# EAGLE design SO2Rduino-V2 (EAGLE 5.10)

## Sheet 1 of 3
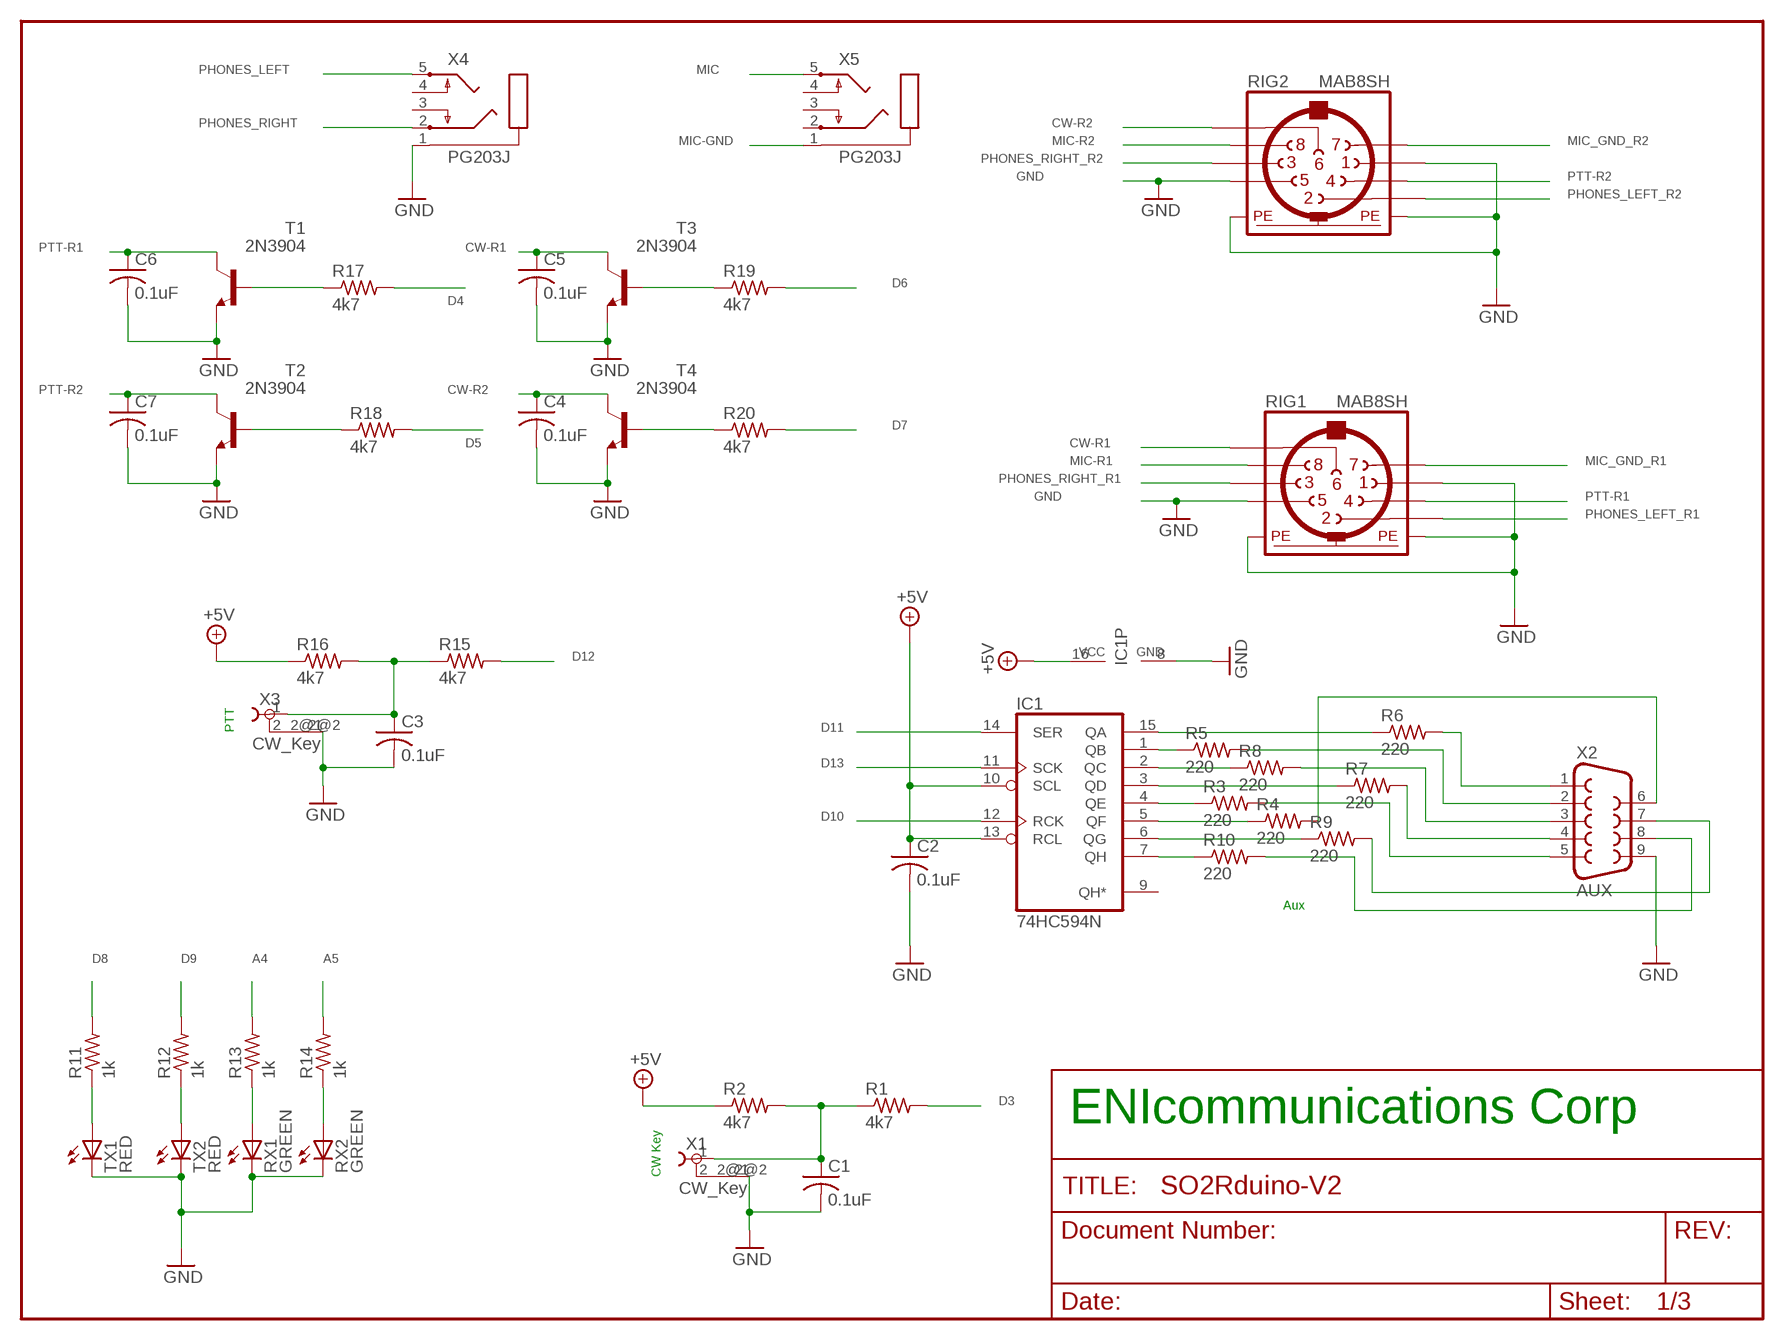
[diagram p0: schematic, sheet 1]

### Parts
C1  0.1uF  C-US025-025X050  [C025-025X050]
C2  0.1uF  C-US025-025X050  [C025-025X050]
C3  0.1uF  C-US025-025X050  [C025-025X050]
C4  0.1uF  C-US025-025X050  [C025-025X050]
C5  0.1uF  C-US025-025X050  [C025-025X050]
C6  0.1uF  C-US025-025X050  [C025-025X050]
C7  0.1uF  C-US025-025X050  [C025-025X050]
IC1  74HC594N  [DIL16]
R1  4k7  R-US_0204/7  [0204/7]
R2  4k7  R-US_0204/7  [0204/7]
R3  220  R-US_0204/7  [0204/7]
R4  220  R-US_0204/7  [0204/7]
R5  220  R-US_0204/7  [0204/7]
R6  220  R-US_0204/7  [0204/7]
R7  220  R-US_0204/7  [0204/7]
R8  220  R-US_0204/7  [0204/7]
R9  220  R-US_0204/7  [0204/7]
R10  220  R-US_0204/7  [0204/7]
R11  1k  R-US_0204/7  [0204/7]
R12  1k  R-US_0204/7  [0204/7]
R13  1k  R-US_0204/7  [0204/7]
R14  1k  R-US_0204/7  [0204/7]
R15  4k7  R-US_0204/7  [0204/7]
R16  4k7  R-US_0204/7  [0204/7]
R17  4k7  R-US_0204/7  [0204/7]
R18  4k7  R-US_0204/7  [0204/7]
R19  4k7  R-US_0204/7  [0204/7]
R20  4k7  R-US_0204/7  [0204/7]
RIG1  MAB8SH  [MAB8SH]
RIG2  MAB8SH  [MAB8SH]
RX1  GREEN  LED5MM  [LED5MM]
RX2  GREEN  LED5MM  [LED5MM]
T1  2N3904  [TO92]
T2  2N3904  [TO92]
T3  2N3904  [TO92]
T4  2N3904  [TO92]
TX1  RED  LED5MM  [LED5MM]
TX2  RED  LED5MM  [LED5MM]
X1  CW_Key  TOBU3  [TOBU3]
X2  AUX  DB9  [DB9]
X3  CW_Key  TOBU3  [TOBU3]
X4  PG203J  [PG203J]
X5  PG203J  [PG203J]

### Nets
+5V: C2.1 IC1.10(SCL) IC1.13(RCL) IC1.16(VCC) R2.1 R16.1 ; also sheet 2,3
A4: R13.2 ; also sheet 3
A5: R14.2 ; also sheet 3
CW-R1: C5.1 RIG1.6 T3.1(C)
CW-R2: C4.1 RIG2.6 T4.1(C)
D3: R1.2 ; also sheet 3
D4: R17.2 ; also sheet 3
D5: R18.2 ; also sheet 3
D6: R19.2 ; also sheet 3
D7: R20.2 ; also sheet 3
D8: R11.2 ; also sheet 3
D9: R12.2 ; also sheet 2,3
D10: IC1.12(RCK) ; also sheet 3
D11: IC1.14(SER) ; also sheet 2,3
D12: R15.2 ; also sheet 3
D13: IC1.11(SCK) ; also sheet 2,3
GND: C1.2 C2.2 C3.2 C4.2 C5.2 C6.2 C7.2 IC1.8(GND) RIG1.1 RIG1.5 RIG1.PE RIG1.PE@(PE) RIG2.1 RIG2.5 RIG2.PE RIG2.PE@(PE) RX1.K(C) RX2.K(C) T1.3(E) T2.3(E) T3.3(E) T4.3(E) TX1.K(C) TX2.K(C) X1.2@2 X2.9 X3.2@2 X4.1 ; also sheet 2,3
MIC: X5.5 ; also sheet 2
MIC-GND: X5.1 ; also sheet 2
MIC-R1: RIG1.8 ; also sheet 2
MIC-R2: RIG2.8 ; also sheet 2
MIC_GND_R1: RIG1.7 ; also sheet 2
MIC_GND_R2: RIG2.7 ; also sheet 2
N$1: C1.1 R1.1 R2.2 X1.1
N$2: IC1.4(QE) R3.1
N$3: R3.2 X2.5
N$4: IC1.3(QD) R7.1
N$5: R7.2 X2.4
N$6: IC1.2(QC) R8.1
N$7: R8.2 X2.3
N$8: IC1.1(QB) R5.1
N$9: R5.2 X2.2
N$10: IC1.15(QA) R6.1
N$11: R6.2 X2.1
N$12: IC1.5(QF) R4.1
N$13: R4.2 X2.6
N$14: IC1.6(QG) R9.1
N$15: IC1.7(QH) R10.1
N$16: R9.2 X2.7
N$17: R10.2 X2.8
N$18: R12.1 TX2.A
N$19: R11.1 TX1.A
N$20: C3.1 R15.1 R16.2 X3.1
N$21: R13.1 RX1.A
N$22: R14.1 RX2.A
N$23: R17.1 T1.2(B)
N$24: R18.1 T2.2(B)
N$25: R19.1 T3.2(B)
N$26: R20.1 T4.2(B)
PHONES_LEFT: X4.5 ; also sheet 2
PHONES_LEFT_R1: RIG1.2 ; also sheet 2
PHONES_LEFT_R2: RIG2.2 ; also sheet 2
PHONES_RIGHT: X4.2 ; also sheet 2
PHONES_RIGHT_R1: RIG1.3 ; also sheet 2
PHONES_RIGHT_R2: RIG2.3 ; also sheet 2
PTT-R1: C6.1 RIG1.4 T1.1(C)
PTT-R2: C7.1 RIG2.4 T2.1(C)
Unconnected: IC1.9(QH*) X1.2 X1.2@1 X3.2 X3.2@1 X4.3 X4.4 X5.2 X5.3 X5.4

### Notes on the sheet
- PTT
- Aux
- ENIcommunications Corp
- CW Key

## Sheet 2 of 3
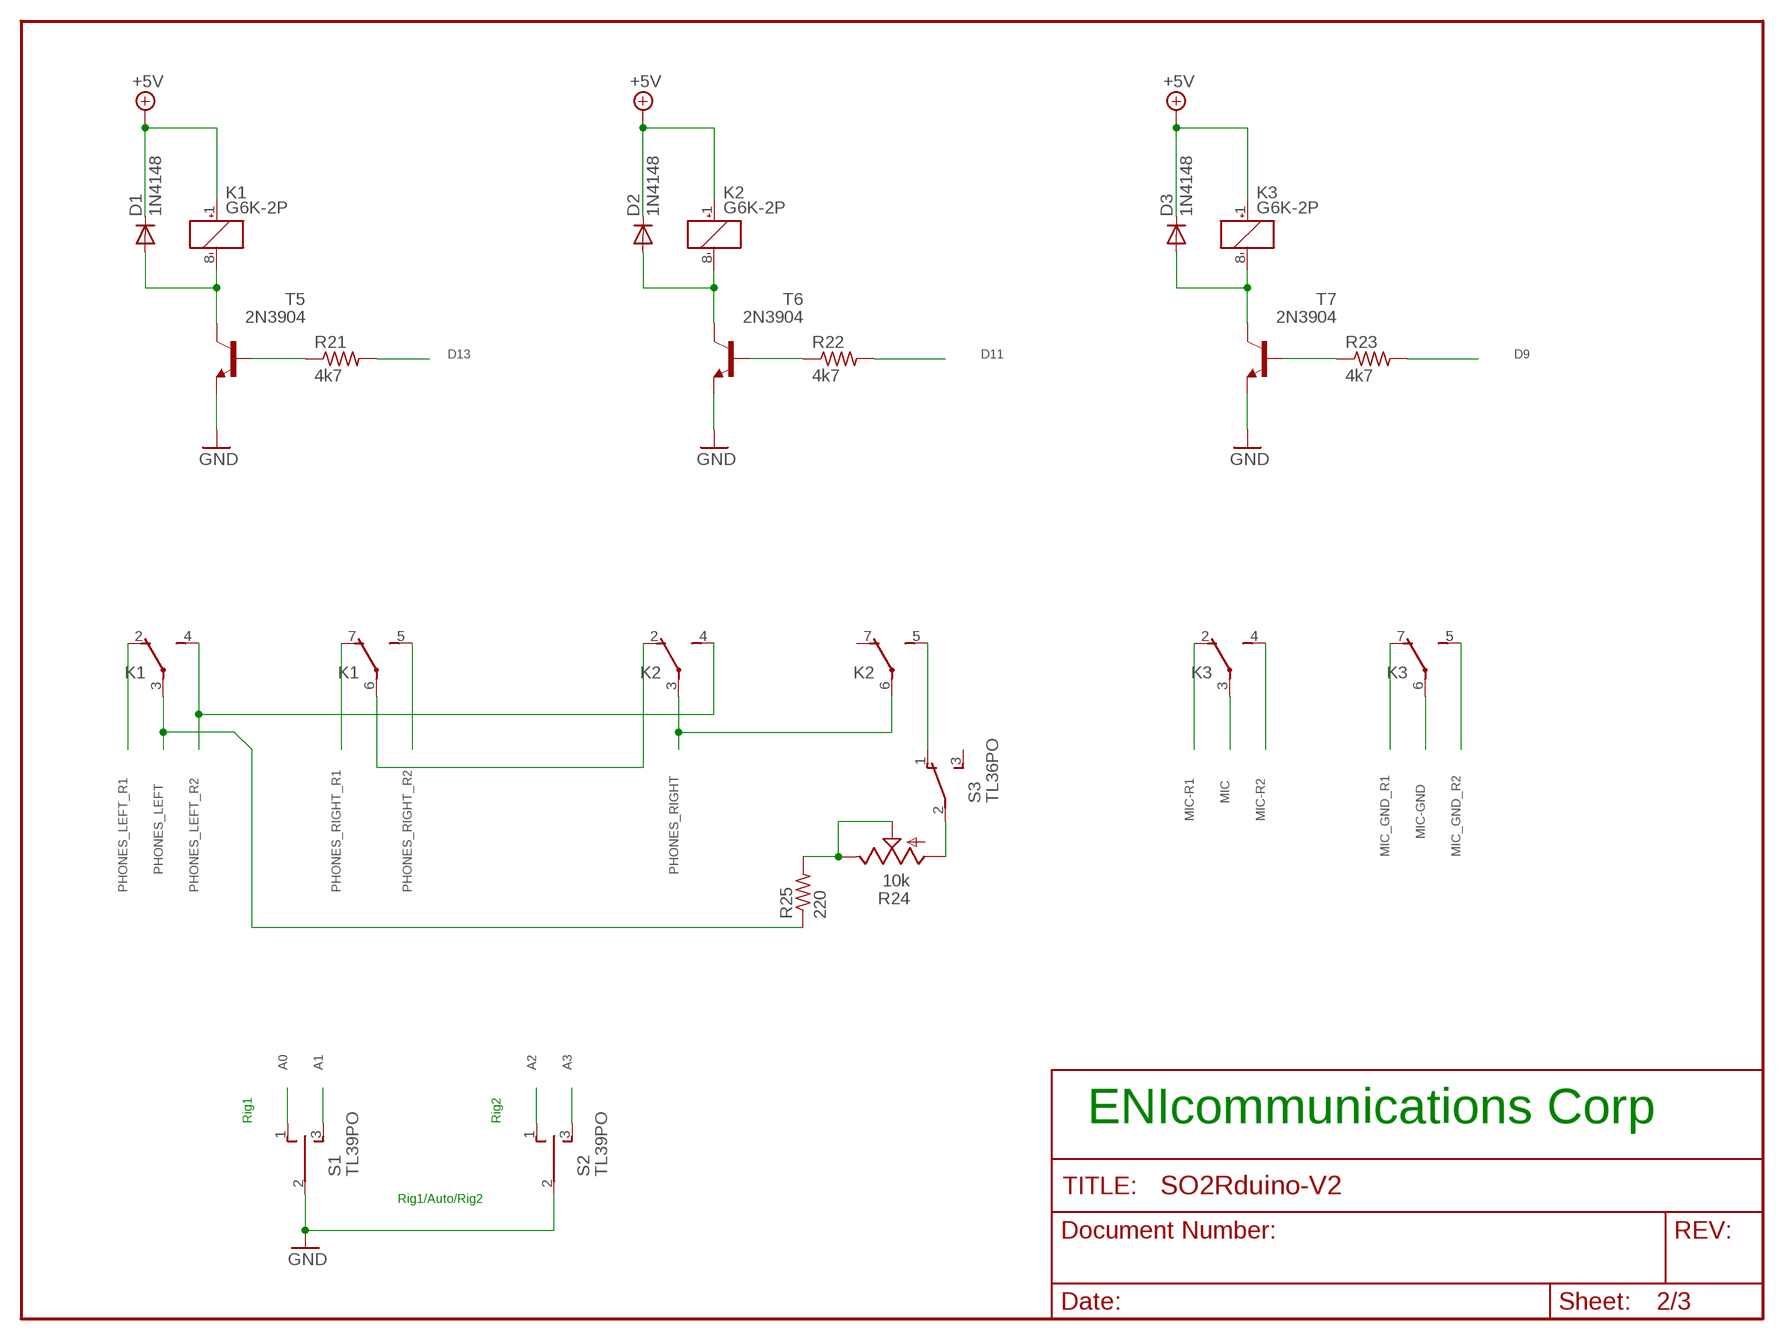
[diagram p1: schematic, sheet 2]

### Parts
D1  1N4148  [DO35-10]
D2  1N4148  [DO35-10]
D3  1N4148  [DO35-10]
K1  G6K-2P  [G6K-2P]
K2  G6K-2P  [G6K-2P]
K3  G6K-2P  [G6K-2P]
R21  4k7  R-US_0204/7  [0204/7]
R22  4k7  R-US_0204/7  [0204/7]
R23  4k7  R-US_0204/7  [0204/7]
R24  10k  TRIM_US-CA6V  [CA6V]
R25  220  R-US_0204/7  [0204/7]
S1  TL39PO  [TL3XPO]
S2  TL39PO  [TL3XPO]
S3  TL36PO  [TL3XPO]
T5  2N3904  [TO92]
T6  2N3904  [TO92]
T7  2N3904  [TO92]

### Nets
+5V: D1.C D2.C D3.C K1.1(1:+) K2.1(1:+) K3.1(1:+) ; also sheet 1,3
A0: S1.1(O) ; also sheet 3
A1: S1.3(S) ; also sheet 3
A2: S2.1(O) ; also sheet 3
A3: S2.3(S) ; also sheet 3
D9: R23.2 ; also sheet 1,3
D11: R22.2 ; also sheet 1,3
D13: R21.2 ; also sheet 1,3
GND: S1.2(P) S2.2(P) T5.3(E) T6.3(E) T7.3(E) ; also sheet 1,3
MIC: K3.3(2:P) ; also sheet 1
MIC-GND: K3.6(3:P) ; also sheet 1
MIC-R1: K3.2(2:O) ; also sheet 1
MIC-R2: K3.4(2:S) ; also sheet 1
MIC_GND_R1: K3.7(3:O) ; also sheet 1
MIC_GND_R2: K3.5(3:S) ; also sheet 1
N$27: D2.A K2.8(1:-) T6.1(C)
N$28: D3.A K3.8(1:-) T7.1(C)
N$29: K2.5(3:S) S3.1(O)
N$30: R24.A S3.2(P)
N$31: R22.1 T6.2(B)
N$32: D1.A K1.8(1:-) T5.1(C)
N$33: R21.1 T5.2(B)
N$34: R23.1 T7.2(B)
N$37: R24.E R24.S R25.2
N$40: K1.6(3:P) K2.2(2:O)
PHONES_LEFT: K1.3(2:P) R25.1 ; also sheet 1
PHONES_LEFT_R1: K1.2(2:O) ; also sheet 1
PHONES_LEFT_R2: K1.4(2:S) K2.4(2:S) ; also sheet 1
PHONES_RIGHT: K2.3(2:P) K2.6(3:P) ; also sheet 1
PHONES_RIGHT_R1: K1.7(3:O) ; also sheet 1
PHONES_RIGHT_R2: K1.5(3:S) ; also sheet 1
Unconnected: K2.7(3:O) S3.3(S)

### Notes on the sheet
- Rig1 | Rig2 | ENIcommunications Corp
- Rig1/Auto/Rig2

## Sheet 3 of 3
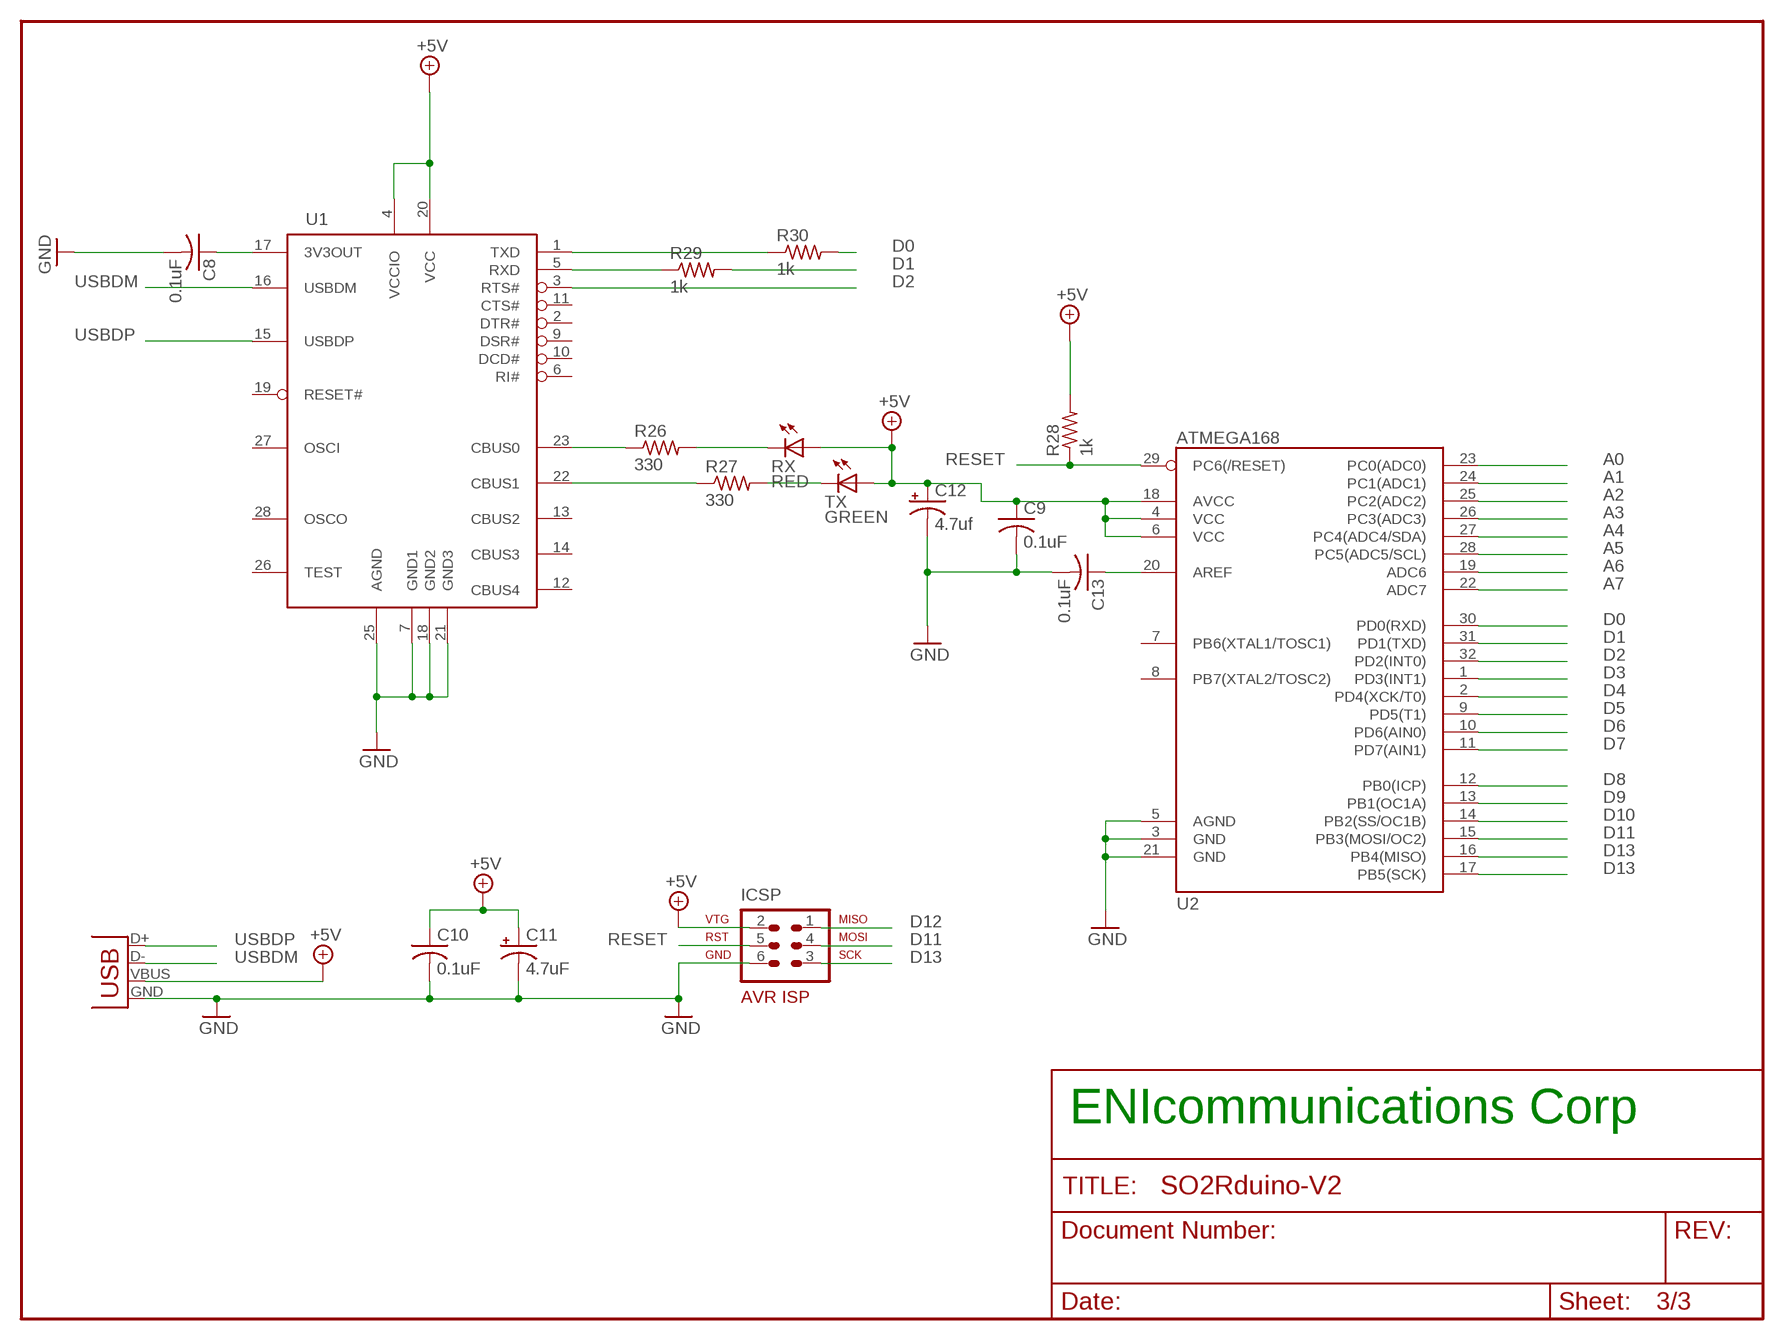
[diagram p2: schematic, sheet 3]

### Parts
C8  0.1uF  C-US025-025X050  [C025-025X050]
C9  0.1uF  C-US025-025X050  [C025-025X050]
C10  0.1uF  C-US025-025X050  [C025-025X050]
C11  4.7uF  CPOL-USE2-5  [E2-5]
C12  4.7uf  CPOL-USE2-5  [E2-5]
C13  0.1uF  C-US025-025X050  [C025-025X050]
ICSP  AVR-ISP-6  [AVR-ISP-6]
R26  330  R-US_0204/7  [0204/7]
R27  330  R-US_0204/7  [0204/7]
R28  1k  R-US_0204/7  [0204/7]
R29  1k  R-US_0204/7  [0204/7]
R30  1k  R-US_0204/7  [0204/7]
RX  RED  LED5MM  [LED5MM]
TX  GREEN  LED5MM  [LED5MM]
U1  FT232RL  [SSOP28DB]
U2  ATMEGA168  [TQFP32-08]
X6  USBPTH  [USB-B-PTH]

### Nets
+5V: C9.1 C10.1 C11.+ C12.+ ICSP.2 R28.2 RX.A TX.A U1.4(VCCIO) U1.20(VCC) U2.4(VCC) U2.6(VCC) U2.18(AVCC) X6.VBUS ; also sheet 1,2
A0: U2.23(PC0(ADC0)) ; also sheet 2
A1: U2.24(PC1(ADC1)) ; also sheet 2
A2: U2.25(PC2(ADC2)) ; also sheet 2
A3: U2.26(PC3(ADC3)) ; also sheet 2
A4: U2.27(PC4(ADC4/SDA)) ; also sheet 1
A5: U2.28(PC5(ADC5/SCL)) ; also sheet 1
A6: U2.19(ADC6)
A7: U2.22(ADC7)
D0: R30.2 U2.30(PD0(RXD))
D1: R29.2 U2.31(PD1(TXD))
D2: U1.3(RTS#) U2.32(PD2(INT0))
D3: U2.1(PD3(INT1)) ; also sheet 1
D4: U2.2(PD4(XCK/T0)) ; also sheet 1
D5: U2.9(PD5(T1)) ; also sheet 1
D6: U2.10(PD6(AIN0)) ; also sheet 1
D7: U2.11(PD7(AIN1)) ; also sheet 1
D8: U2.12(PB0(ICP)) ; also sheet 1
D9: U2.13(PB1(OC1A)) ; also sheet 1,2
D10: U2.14(PB2(SS/OC1B)) ; also sheet 1
D11: ICSP.4 U2.15(PB3(MOSI/OC2)) ; also sheet 1,2
D12: ICSP.1 ; also sheet 1
D13: ICSP.3 U2.16(PB4(MISO)) U2.17(PB5(SCK)) ; also sheet 1,2
GND: C8.2 C9.2 C10.2 C11.- C12.- C13.2 ICSP.6 U1.7(GND1) U1.18(GND2) U1.21(GND3) U1.25(AGND) U2.3(GND) U2.5(AGND) U2.21(GND) X6.GND ; also sheet 1,2
N$35: R26.1 U1.23(CBUS0)
N$36: R27.1 U1.22(CBUS1)
N$38: R26.2 RX.K(C)
N$39: R27.2 TX.K(C)
N$42: C13.1 U2.20(AREF)
N$43: C8.1 U1.17(3V3OUT)
RESET: ICSP.5 R28.1 U2.29(PC6(/RESET))
RX: R30.1 U1.1(TXD)
TX: R29.1 U1.5(RXD)
USBDM: U1.16(USBDM) X6.D-
USBDP: U1.15(USBDP) X6.D+
Unconnected: U1.2(DTR#) U1.6(RI#) U1.9(DSR#) U1.10(DCD#) U1.11(CTS#) U1.12(CBUS4) U1.13(CBUS2) U1.14(CBUS3) U1.19(RESET#) U1.26(TEST) U1.27(OSCI) U1.28(OSCO) U2.7(PB6(XTAL1/TOSC1)) U2.8(PB7(XTAL2/TOSC2))

### Notes on the sheet
- ENIcommunications Corp

## Library data of the parts
C1-C7 = rcl:C-US: CAPACITOR, American symbol
C8-C10 C13 = resistor:C-US: CAPACITOR, American symbol
C11 C12 = rcl:CPOL-US: POLARIZED CAPACITOR, American symbol
D1-D3 = diode:1N4148: DIODE high speed (Philips)
IC1 = 74xx-eu:74*594: 8-bit SHIFT REGISTER, output latch
ICSP = avr-6:AVR-ISP-6: AVR ISP-6 Serial Programming Header
K1-K3 = relay:G6K: Low Signal Relay oeiwcsnts1.omron.com/.. D20G6K0100.pdf
R1-R23 R25-R30 = resistor:R-US_: RESISTOR, American symbol
R24 = pot:TRIM_US-: POTENTIOMETER
RIG1 RIG2 = con-hirschmann:MAB8SH: Female CONNECTOR 8 pins with shield, horizontal (DIN 41524)
RX RX1 RX2 TX TX1 TX2 = led:LED: LED OSRAM: - CHIPLED LG R971, LG N971, LY N971, LG Q971, LY Q971, LO R971, LY R971 LH N974, LH R974 LS Q976, LO Q976, LY Q976 LO Q996 - Hyper CHIPLED LW Q18S LB Q993, LB Q99A, LB R99A - SideLED LS A670, LO A670, LY A670, LG A670, LP A670 LB A673, LV A673, LT A673, LW A673 LH A674 LY A675 LS A676, LA A676, LO A676, LY A676, LW A676 LS A679, LY A679, LG A679 - Hyper Micro SIDELED® LS Y876, LA Y876, LO Y876, LY Y876 LT Y87S - SmartLED LW L88C, LW L88S LB L89C, LB L89S, LG L890 LS L89K, LO L89K, LY L89K LS L896, LA L896, LO L896, LY L896 - TOPLED LS T670, LO T670, LY T670, LG T670, LP T670 LSG T670, LSP T670, LSY T670, LOP T670, LYG T670 LG T671, LOG T671, LSG T671 LB T673, LV T673, LT T673, LW T673 LH T674 LS T676, LA T676, LO T676, LY T676, LB T676, LH T676, LSB T676, LW T676 LB T67C, LV T67C, LT T67C, LS T67K, LO T67K, LY T67K, LW E67C LS E67B, LA E67B, LO E67B, LY E67B, LB E67C, LV E67C, LT E67C LW T67C LS T679, LY T679, LG T679 LS T770, LO T770, LY T770, LG T770, LP T770 LB T773, LV T773, LT T773, LW T773 LH T774 LS E675, LA E675, LY E675, LS T675 LS T776, LA T776, LO T776, LY T776, LB T776 LHGB T686 LT T68C, LB T68C - Hyper Mini TOPLED® LB M676 - Mini TOPLED Santana® LG M470 LS M47K, LO M47K, LY M47K Source: http://www.osram.convergy.de/
S1 S2 = switch:TL39PO: TINY SWITCH ON OFF ON Source: http://www2.produktinfo.conrad.com/datenblaetter/700000-724999/705152-da-01-de-Subminiaturschalter_TL_36YO.pdf
S3 = switch:TL36PO: TINY SWITCH ON - ON Source: http://www2.produktinfo.conrad.com/datenblaetter/700000-724999/705152-da-01-de-Subminiaturschalter_TL_36YO.pdf
T1-T7 = transistor:2N3904: NPN TRANSISTOR
U1 = ftdichip-4:FT232RL: USB UART 4th Generation USB UART (USB <-> Serial) Controller
U2 = SparkFun:ATMEGA168
X1 X3 = con-hirschmann:TOBU3: Female Cinch CONNECTOR ( RCA Jack )
X2 = SparkFun:DB9: DB9 Connector Standard DB9 (D-Sub 9) serial connector. Can be used for CAN bus as well as RS485 and RS232. Footprint production proven. Spark Fun Electronics SKU : PRT-00429
X4 X5 = con-hirschmann:PG203J: MIC/HEADPHONE JACK KS-S stereo microphone/headphone jack PG203JN (Schukat)
X6 = SparkFun:USB: USB Connectors USB-B-PTH is fully proven SKU : PRT-00139 USB-miniB is fully proven SKU : PRT-00587 USB-A-PCB is untested. USB-A-H is throughly reviewed, but untested. Spark Fun Electronics SKU : PRT-00437 USB-B-SMT is throughly reviewed, but untested. Needs silkscreen touching up. USB-A-S has not been used/tested USB-MB-H has not been used/tested

## Board
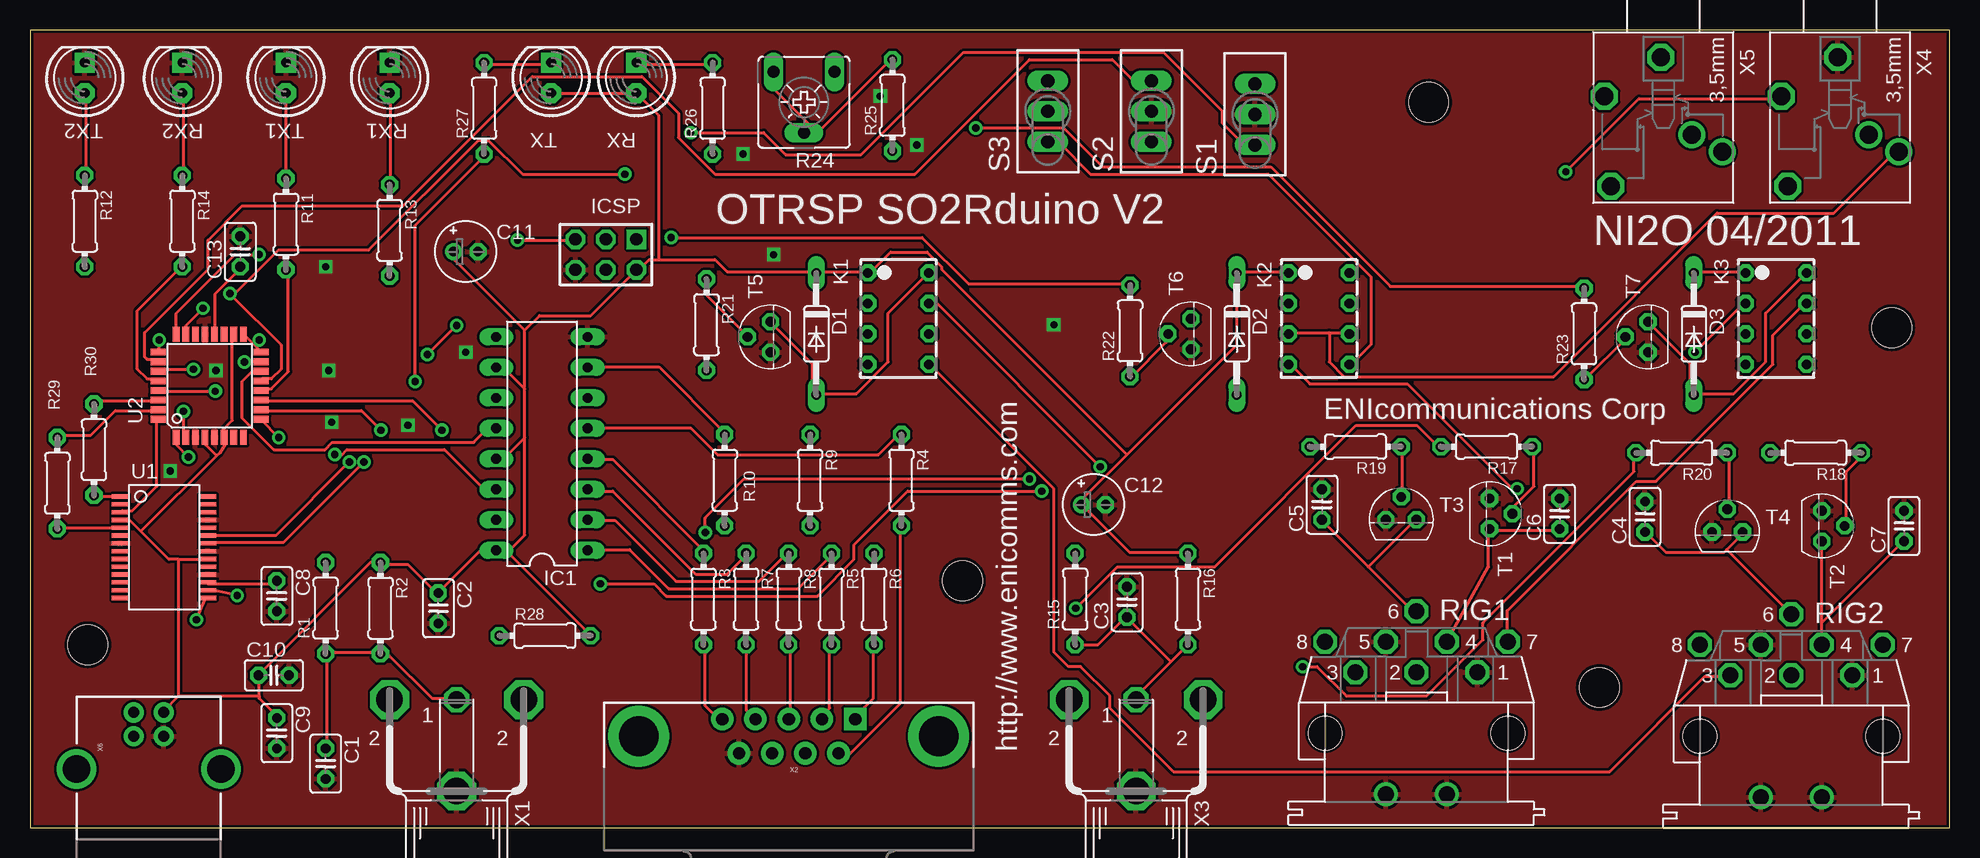
[diagram p3: board, top side]
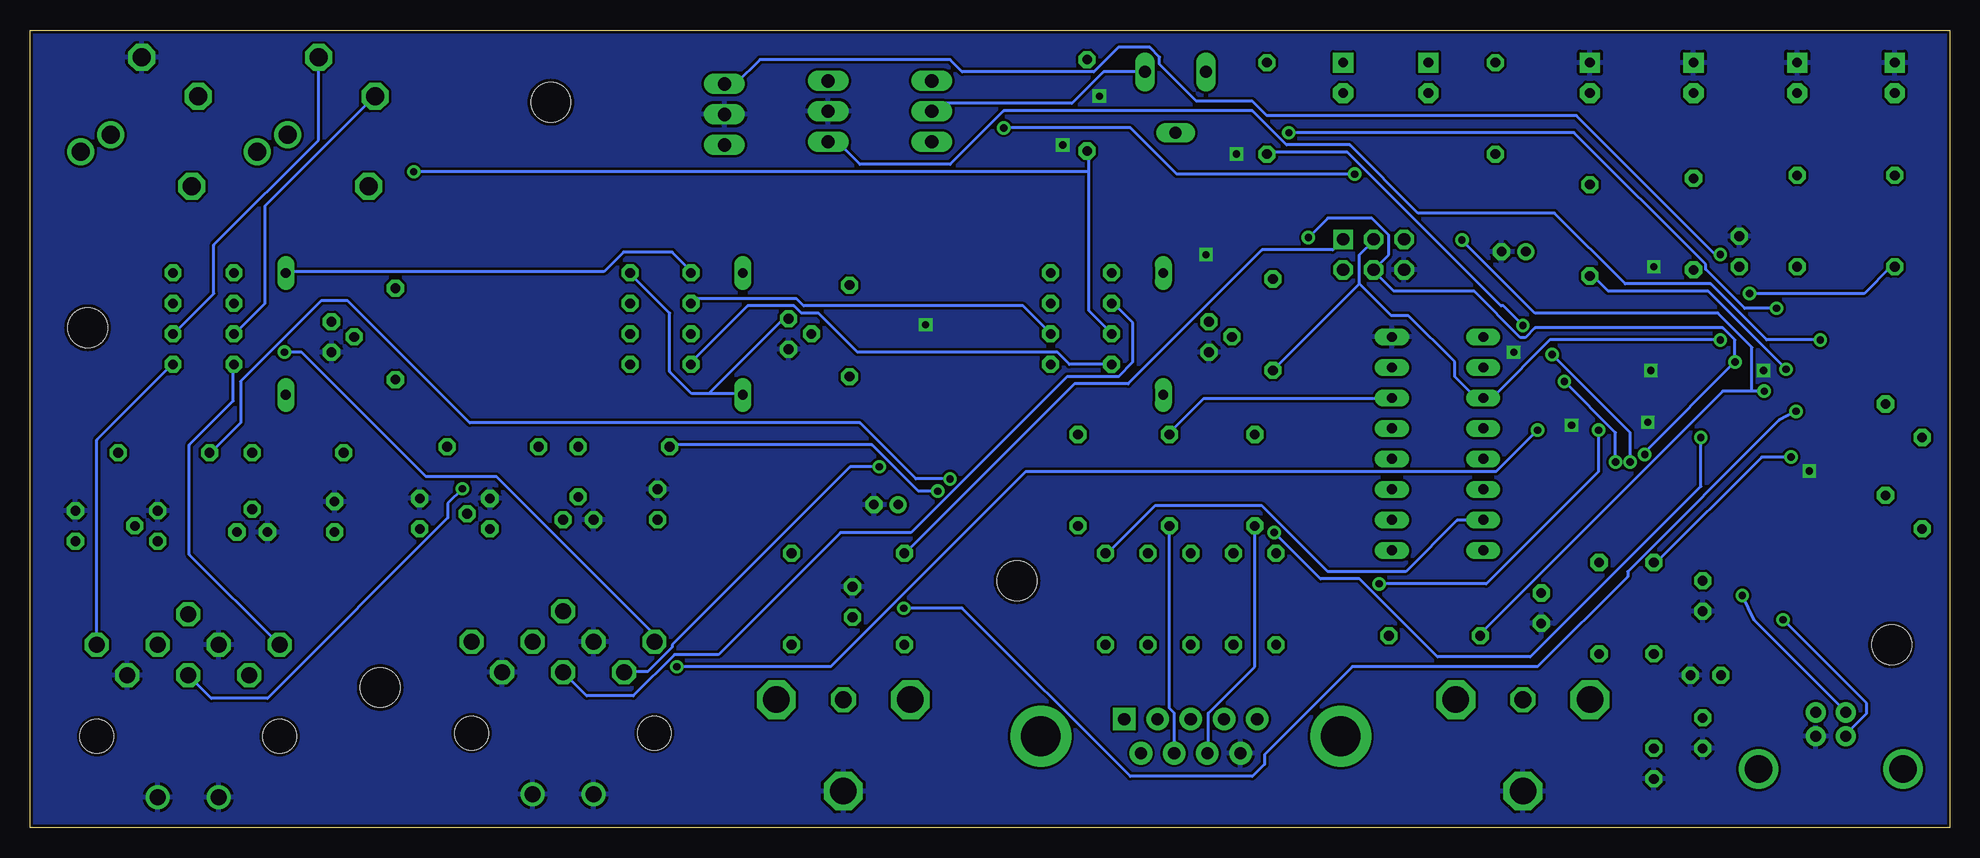
[diagram p4: board, bottom side, seen from below]

Size 160 x 66.47 mm. Coordinates in mm from the lower left corner, seen from the top.
Outline: 0,0 160,0 160,66.47 0,66.47 0,0
Copper layers (1*16): Top 0.035mm / dielectric 1.5mm / Bottom 0.035mm
Design rules "SparkFun": minimum track width 8mil, minimum drill 20mil, track to track 8mil, track to pad 8mil, pad to pad 8mil, via to via 8mil, smd to smd 8mil, copper to edge 10mil, drill to drill 8mil, minimum pad ring 12mil, minimum via ring 10mil, stop-mask expansion 4mil, vias tented up to drill 25mil, thermal gap 10mil

### Footprints (pad centres in the part's own frame; a part is rotated, then mirrored left to right if it is on the bottom)
C025-025X050 = drill 0.813 octagon: 1 -1.27,0; 2 1.27,0
E2-5 = drill 0.813 pad 1.27 round: + -1.016,0 | drill 0.813 pad 1.27 octagon: - 1.016,0
DO35-10 = drill 0.813 long: A 5.08,0; C -5.08,0
DIL16 = drill 0.813 long: 1 -8.89,-3.81; 2 -6.35,-3.81; 3 -3.81,-3.81; 4 -1.27,-3.81; 5 1.27,-3.81; 6 3.81,-3.81; 7 6.35,-3.81; 8 8.89,-3.81; 9 8.89,3.81; 10 6.35,3.81; 11 3.81,3.81; 12 1.27,3.81; 13 -1.27,3.81; 14 -3.81,3.81; 15 -6.35,3.81; 16 -8.89,3.81
AVR-ISP-6 = drill 1.016 square: 1 -2.54,-1.27 | drill 1.016 octagon: 2 -2.54,1.27; 3 0,-1.27; 4 0,1.27; 5 2.54,-1.27; 6 2.54,1.27
G6K-2P = drill 0.8 octagon: 1 -2.54,-2.54; 2 0,-2.54; 3 2.54,-2.54; 4 5.08,-2.54; 5 5.08,2.54; 6 2.54,2.54; 7 0,2.54; 8 -2.54,2.54
0204/7 = drill 0.813 octagon: 1 -3.81,0; 2 3.81,0
CA6V = drill 1.016 long: A -2.54,-2.54; E 2.54,-2.54; S 0,2.54
MAB8SH = drill 1.321 octagon: 1 5.08,5.08; 2 0,5.08; 3 -5.08,5.08; 4 2.54,7.62; 5 -2.54,7.62; 6 0,10.16; 7 7.62,7.62; 8 -7.62,7.62 | drill 1.321 round: PE -2.54,-5.08; PE@ 2.54,-5.08 | hole 2.794: -7.62,0; 7.62,0
LED5MM = drill 0.813 pad 1.676 octagon: A -1.27,0 | drill 0.813 pad 1.676 square: K 1.27,0
TL3XPO = drill 1.1 pad 1.422 long: 1 -2.54,0; 2 0,0; 3 2.54,0
TO92 = drill 0.813 octagon: 1 1.27,0; 2 0,1.905; 3 -1.27,0
SSOP28DB = smd 0.348 x 1.397: 1 -4.225,-3.656; 2 -3.575,-3.656; 3 -2.925,-3.656; 4 -2.275,-3.656; 5 -1.625,-3.656; 6 -0.975,-3.656; 7 -0.325,-3.656; 8 0.325,-3.656; 9 0.975,-3.656; 10 1.625,-3.656; 11 2.275,-3.656; 12 2.925,-3.656; 13 3.575,-3.656; 14 4.225,-3.656; 15 4.225,3.656; 16 3.575,3.656; 17 2.925,3.656; 18 2.275,3.656; 19 1.625,3.656; 20 0.975,3.656; 21 0.325,3.656; 22 -0.325,3.656; 23 -0.975,3.656; 24 -1.625,3.656; 25 -2.275,3.656; 26 -2.925,3.656; 27 -3.575,3.656; 28 -4.225,3.656
TQFP32-08 = smd 1.27 x 0.559: 1 -4.293,2.8; 2 -4.293,2; 3 -4.293,1.2; 4 -4.293,0.4; 5 -4.293,-0.4; 6 -4.293,-1.2; 7 -4.293,-2; 8 -4.293,-2.8; 17 4.293,-2.8; 18 4.293,-2; 19 4.293,-1.2; 20 4.293,-0.4; 21 4.293,0.4; 22 4.293,1.2; 23 4.293,2; 24 4.293,2.8 | smd 0.559 x 1.27: 9 -2.8,-4.293; 10 -2,-4.293; 11 -1.2,-4.293; 12 -0.4,-4.293; 13 0.4,-4.293; 14 1.2,-4.293; 15 2,-4.293; 16 2.8,-4.293; 25 2.8,4.293; 26 2,4.293; 27 1.2,4.293; 28 0.4,4.293; 29 -0.4,4.293; 30 -1.2,4.293; 31 -2,4.293; 32 -2.8,4.293
STAND-OFF = hole 3.302: 0,0
TOBU3 = drill 1.397 octagon: 1 0,-2.54 | drill 2.21 octagon: 2 5.588,-2.54; 2@1 -5.588,-2.54; 2@2 0,5.08
DB9 = drill 1.016 pad 1.88 square: 1 -5.54,-1.42 | drill 1.016 pad 1.88 round: 2 -2.77,-1.42; 3 0,-1.42; 4 2.77,-1.42; 5 5.54,-1.42; 6 -4.15,1.42; 7 -1.38,1.42; 8 1.38,1.42; 9 4.15,1.42 | drill 3.302 pad 5.08 round: G1 -12.5,0; G2 12.5,0
PG203J = drill 1.499 octagon: 1 -5.004,-0.203; 4 5.74,-4.369; 5 -1.753,-4.902 | drill 1.499 round: 2 2.845,4.902; 3 1.448,2.388
USB-B-PTH = drill 0.914 pad 1.676 round: D+ 0,1.25; D- 1.981,1.25; GND 0,-1.25; VBUS 1.981,-1.25 | drill 2.286 round: P$1 -2.718,-6.02; P$2 -2.718,6.02

### Placement (x,y rotation side)
C1  24.64,5.33 270 top
C2  34.04,18.29 270 top
C3  91.44,18.8 90 top
C4  134.62,25.91 90 top
C5  107.7,26.92 90 top
C6  127.51,26.16 90 top
C7  156.21,25.15 90 top
C8  20.57,19.3 270 top
C9  20.57,7.87 270 top
C10  20.32,12.7 0 top
C11  36.32,48.01 0 top
C12  88.65,26.92 0 top
C13  17.53,48.01 90 top
D1  65.53,41.15 270 top
D2  100.58,41.15 270 top
D3  138.68,41.15 270 top
IC1  42.67,32 90 top
ICSP  48.01,47.75 180 top
K1  72.39,43.69 270 top
K2  107.44,43.69 270 top
K3  145.54,43.69 270 top
R1  24.64,18.29 90 top
R2  29.21,18.29 270 top
R3  56.13,19.05 270 top
R4  72.64,28.96 270 top
R5  66.8,19.05 270 top
R6  70.36,19.05 270 top
R7  59.69,19.05 270 top
R8  63.25,19.05 270 top
R9  65.02,28.96 270 top
R10  57.91,28.96 270 top
R11  21.34,50.29 270 top
R12  4.57,50.55 270 top
R13  29.97,49.78 270 top
R14  12.7,50.55 270 top
R15  87.12,19.05 90 top
R16  96.52,19.05 270 top
R17  121.41,31.75 180 top
R18  148.84,31.24 180 top
R19  110.49,31.75 180 top
R20  137.67,31.24 180 top
R21  56.39,41.91 270 top
R22  91.69,41.4 90 top
R23  129.54,41.15 90 top
R24  64.52,60.45 180 top
R25  71.88,60.2 90 top
R26  56.9,59.94 90 top
R27  37.85,59.94 90 top
R28  42.93,16 0 top
R29  2.29,28.7 90 top
R30  5.33,31.5 90 top
RIG1  115.57,7.87 0 top
RIG2  146.81,7.62 0 top
RX  50.55,62.48 90 top
RX1  29.97,62.48 90 top
RX2  12.7,62.48 90 top
S1  102.11,59.44 90 top
S2  93.47,59.69 90 top
S3  84.84,59.69 90 top
T1  121.67,26.16 270 top
T2  149.35,25.15 270 top
T3  114.3,25.65 0 top
T4  141.48,24.64 0 top
T5  61.72,40.89 90 top
T6  96.77,41.15 90 top
T7  134.87,40.89 90 top
TX  43.43,62.48 90 top
TX1  21.34,62.48 90 top
TX2  4.57,62.48 90 top
U1  11.18,23.37 270 top
U2  14.99,36.83 90 top
U$1  [STAND-OFF]  155.19,41.66 0 top
U$2  [STAND-OFF]  4.83,15.24 0 top
U$3  [STAND-OFF]  130.81,11.68 0 top
U$4  [STAND-OFF]  77.72,20.57 0 top
U$5  [STAND-OFF]  116.59,60.45 0 top
X1  35.56,8.13 180 top
X2  63.25,7.62 180 top
X3  92.2,8.13 180 top
X4  150.88,59.18 270 top
X5  136.14,59.18 270 top
X6  9.91,7.62 90 top

### Tracks (layer width: path | path; a pad name or v marks a point on that pad's centre or on a via)
+5V
  Top 0.254: K3.1 142.85,46.33 138.79,46.33 D3.C | K2.1 104.85,46.33 100.58,46.33 D2.C 100.58,40.23 91.44,31.09 | R16.1 96.52,22.96 91.64,22.96 87.78,26.82 C12.+ 87.78,27.03 87.78,27.43 91.44,31.09 | 19.1,10.97 19.1,10.77 20.73,9.14 C9.1 | 19.1,10.97 19.1,12.6 C10.1 19.1,12.8 28.45,22.15 29.06,22.15 R2.1 29.26,21.95 31.5,21.95 33.93,19.51 C2.1 34.14,19.71 37.59,23.16 38.81,23.16 IC1.16 | 12.39,10.97 11.18,9.75 X6.VBUS | 12.39,10.97 19.1,10.97 | 12.39,22.35 11.58,22.35 9.25,24.69 | 12.39,22.35 14.63,22.35 U1.20 | 9.25,24.69 8.33,25.6 7.72,25.6 U1.4 | 15.54,30.99 14.63,31.9 14.63,32.51 U2.4 | 15.54,30.99 15.85,31.24 16.26,31.9 16.26,32.51 U2.6 16.05,32.72 16.05,33.12 16.87,33.93 16.87,41.05 U2.18 | 9.25,24.69 15.54,30.99 | 12.39,10.97 12.39,22.35 | 39.83,22.96 46.74,16.05 R28.2 | 39.83,22.96 39.01,22.96 IC1.16 | TX.A 43.48,61.16 50.39,61.16 RX.A 52.43,59.33 52.43,47.35 | 41.25,32.51 39.62,30.89 39.01,30.89 IC1.13 | 41.25,32.51 41.25,36.58 | 41.25,36.58 39.62,38.2 39.01,38.2 IC1.10 | 41.25,41.45 35.36,47.35 35.36,47.95 C11.+ | 41.25,36.58 41.25,41.45 | 41.25,41.45 42.47,42.67 46.74,42.67 ICSP.2 50.6,46.33 51.61,47.35 52.43,47.35 | 52.43,47.35 57.1,47.35 58.12,46.33 65.43,46.33 D1.C 65.63,46.33 69.7,46.33 K1.1 69.9,46.13 71.73,47.95 74.78,47.95 76,46.74 76,46.53 91.44,31.09 | 39.83,22.96 41.25,24.38 41.25,32.51 | IC1.16 39.83,22.96
  Bottom 0.254: D3.C 138.58,46.33 112.17,46.33 110.54,47.95 106.48,47.95 104.85,46.33 K2.1
A0  (via drill 0.61)
  Top 0.254: v14.43,43.28 13.01,41.86 13.01,41.25 U2.23 | v55.07,57.91 61.16,57.91 62.99,56.08 69.29,56.08 77.83,64.62 94.49,64.62 99.36,59.74 99.36,58.73 101.19,56.9 S1.1
  Bottom 0.254: v14.43,43.28 17.07,43.28 20.32,46.53 20.32,46.94 31.29,57.91 v55.07,57.91
A1  (via drill 0.61)
  Top 0.254: v19.1,47.75 17.07,47.75 12.19,42.88 12.19,41.25 U2.24
  Bottom 0.254: v19.1,47.75 19.51,47.75 31.09,59.33 56.9,59.33 58.12,60.55 62.79,60.55 65.84,63.6 65.84,64.21 66.65,65.02 69.29,65.02 71.32,62.99 82.3,62.99 83.31,64.01 99.16,64.01 101.19,61.98 S1.3
A2  (via drill 0.61)
  Top 0.254: v10.77,40.64 10.77,39.83 U2.25
  Bottom 0.254: v10.77,40.64 15.24,40.64 19.91,45.31 27.03,45.31 32.92,51.21 44.3,51.21 49.99,56.9 55.27,56.9 58.12,59.74 78.84,59.74 83.31,55.27 90.83,55.27 92.66,57.1 93.47,57.1 S2.1
A3
  Top 0.254: U2.26 10.57,39.01 9.75,39.01 9.55,39.22 9.55,41.25 14.83,46.53 14.83,48.97 17.68,51.82 31.09,51.82 41.86,62.59 51,62.59 54.05,59.54 54.05,57.51 57.1,54.46 73.76,54.46 83.31,64.01 90.22,64.01 91.85,62.38 93.47,62.38 S2.3
A4  (via drill 0.61)
  Top 0.254: v13.61,38.2 10.77,38.2 U2.27
  Bottom 0.254: v13.61,38.2 20.12,44.7 28.45,44.7 29.87,46.13 R13.2
A5
  Top 0.254: U2.28 10.57,37.39 9.75,37.39 8.94,38.2 8.94,43.08 12.6,46.74 R14.2
CW-R1
  Top 0.254: 111.56,21.74 115.42,17.88 RIG1.6 | 111.56,21.74 107.7,25.6 C5.1 | 111.56,21.74 115.42,25.6 T3.1
CW-R2
  Top 0.254: 141.43,23.16 142.85,24.59 T4.1 | 141.43,23.16 141.22,22.96 136.35,22.96 134.72,24.59 C4.1 | 141.43,23.16 RIG2.6
D0
  Top 0.254: U2.30 10.57,35.56 5.69,35.56 5.49,35.36 R30.2
D1
  Top 0.254: U2.31 10.57,34.75 7.11,34.75 5.08,32.72 2.64,32.72 2.44,32.51 R29.2
D2
  Top 0.254: U2.32 10.57,33.93 10.57,28.45 8.53,26.42 7.72,26.42 U1.3
D3  (via drill 0.61)
  Top 0.254: v13.21,30.89 12.19,31.9 12.19,32.51 U2.1
  Bottom 0.254: v13.21,30.89 15.65,30.89 24.59,21.95 R1.2
D4  (via drill 0.61)
  Top 0.254: v12.8,34.7 12.8,32.72 U2.2 | v87.17,18.29 90.63,21.74 98.75,21.74 110.54,33.53 115.62,33.53 117.45,31.7 R17.2
  Bottom 0.254: v12.8,34.7 14.22,33.93 26.82,21.34 26.82,20.93 34.34,13.41 49.78,13.41 57.1,6.1 57.1,5.28 58.12,4.27 68.28,4.27 82.3,18.29 v87.17,18.29
D5  (via drill 0.61)
  Top 0.254: v20.73,32.51 19.3,33.93 U2.9 | v56.29,24.59 56.29,25.81 59.54,29.06 v83.31,29.06
  Bottom 0.254: v20.73,32.51 20.73,28.45 34.95,14.22 42.67,14.22 49.17,20.73 52.43,20.73 v56.29,24.59 | v83.31,29.06 86.16,29.06 90.83,33.73 123.34,33.73 133.5,43.89 135.74,43.89 142.44,37.19 142.44,33.73 144.88,31.29 R18.2
D6  (via drill 0.61)
  Top 0.254: v29.26,33.12 27.64,34.75 19.3,34.75 U2.10 | v47.55,20.32 52.02,20.32 53.03,19.3 65.63,19.3 68.68,22.35 68.68,23.57 73.15,28.04 v84.33,28.04
  Bottom 0.254: v29.26,33.12 29.26,29.67 38.61,20.32 v47.55,20.32 | v84.33,28.04 85.95,28.04 89.81,31.9 106.68,31.9 R19.2
D7  (via drill 0.61)
  Top 0.254: v34.34,33.12 31.9,35.56 19.3,35.56 U2.11 | v106.07,13.41 107.29,13.41 109.73,10.97 116.43,10.97 121.11,15.65 121.11,17.07 133.71,29.67 133.71,31.09 R20.2
  Bottom 0.254: v34.34,33.12 37.8,29.67 77.01,29.67 93.27,13.41 v106.07,13.41
D8
  Top 0.254: U2.12 19.3,36.58 20.12,36.58 21.54,38 21.54,46.13 21.34,46.33 R11.2
D9  (via drill 0.61)
  Top 0.254: 16.87,44.3 20.93,40.23 20.93,38.2 20.12,37.39 19.3,37.39 U2.13 | v78.84,58.32 86.16,58.32 89.41,55.07 103.43,55.07 113.39,45.11 129.44,45.11 R23.2 | v49.58,54.46 41.05,54.46 38.2,57.3 37.39,57.3 28.25,48.16 20.73,48.16 16.87,44.3 | v16.66,44.5 16.87,44.3
  Bottom 0.254: v16.66,44.5 7.11,44.5 4.88,46.74 R12.2 | v78.84,58.32 68.28,58.32 64.41,54.46 v49.58,54.46
D10
  Top 0.254: U2.14 19.1,38 18.49,38 17.68,37.19 17.68,34.14 20.32,31.5 24.59,31.5 25.2,32.11 36.98,32.11 38,33.12 38.81,33.12 IC1.12
D11  (via drill 0.61)
  Top 0.254: v17.88,38.81 19.1,38.81 U2.15 | v25.4,31.09 26.01,31.09 26.42,31.5 34.54,31.5 37.8,28.25 38.81,28.25 IC1.14 | v53.44,49.17 74.37,49.17 78.23,45.31 91.64,45.31 R22.2
  Bottom 0.254: v25.4,31.09 25.4,31.29 v17.88,38.81 17.88,40.64 18.9,41.66 34.54,41.66 35.36,40.84 35.76,40.84 39.62,44.7 46.33,44.7 47.95,46.33 ICSP.4 46.74,47.75 46.74,49.38 48.16,50.8 51.82,50.8 v53.44,49.17
D12
  Bottom 0.254: R15.2 86.97,22.96 72.95,36.98 68.48,36.98 57.3,48.16 51.41,48.16 ICSP.1
D13  (via drill 0.61)
  Top 0.254: 18.69,40.23 17.88,41.05 U2.17 | 18.69,40.23 19.1,39.83 U2.16 | 18.69,40.23 v19.1,40.64
  Bottom 0.254: 49.17,45.31 49.17,47.75 47.95,48.97 ICSP.3 | 49.17,45.31 R21.2 | v19.1,40.64 33.33,40.64 38,35.97 38.81,35.97 IC1.11 39.01,35.97 39.62,35.97 41.25,37.59 41.25,38.81 45.11,42.67 46.53,42.67 49.17,45.31
GND  (via drill 0.6)
  other vias: 15.49,38.1 24.89,38.1 31.5,33.53 25.15,33.78 36.32,39.62 24.64,46.74 59.44,56.13 61.98,47.75 85.34,41.91 73.91,56.9 70.87,60.96 11.68,29.72
  pour Bottom: 0,0 160.02,0 160.27,66.55 -0.25,66.29
  pour Top: 0,0 160.02,0 160.02,66.29 0,66.29
MIC
  Bottom 0.254: K3.3 142.85,41.25 140.41,43.69 140.41,51.82 131.27,60.96 X5.5
MIC-GND
  Bottom 0.254: K3.6 147.93,41.25 144.68,44.5 144.68,48.56 135.94,57.3 X5.1
MIC-R1  (via drill 0.61)
  Top 0.254: v138.79,39.62 142.85,43.69 K3.2
  Bottom 0.254: v138.79,39.62 137.36,39.62 127,29.26 121.11,29.26 108.1,16.26 108.1,15.65 RIG1.8
MIC-R2
  Bottom 0.254: RIG2.8 146.71,22.76 146.71,31.9 143.05,35.56 143.05,38.61 K3.4
MIC_GND_R1
  Top 0.254: K3.7 147.93,43.69 145.29,41.05 145.29,38.61 135.53,28.85 133.91,28.85 123.14,18.09 123.14,15.65 RIG1.7
MIC_GND_R2
  Bottom 0.254: RIG2.7 154.43,32.31 148.13,38.61 K3.5
N$1
  Top 0.254: C1.1 24.79,6.71 24.79,14.43 R1.1 24.79,14.63 29.06,14.63 R2.2 29.26,14.43 29.87,14.43 33.53,10.77 35.56,10.77 X1.1
N$2
  Top 0.254: IC1.4 46.53,30.68 48.56,30.68 56.29,22.96 R3.1
N$3
  Top 0.254: R3.2 56.29,15.24 56.29,10.16 57.51,8.94 X2.5
N$4
  Top 0.254: IC1.3 46.53,28.04 48.56,28.04 55.47,21.13 58.12,21.13 59.74,22.76 R7.1
N$5
  Top 0.254: R7.2 59.74,15.24 59.74,9.75 60.35,9.14 X2.4
N$6
  Top 0.254: IC1.2 46.53,25.6 48.77,25.6 53.85,20.52 60.76,20.52 63.2,22.96 R8.1
N$7
  Top 0.254: R8.2 63.4,15.24 63.4,9.14 X2.3
N$8
  Top 0.254: IC1.1 46.53,23.16 49.99,23.16 53.24,19.91 64.01,19.91 66.85,22.76 R5.1
N$9
  Top 0.254: R5.2 66.65,15.24 66.65,9.96 65.84,9.14 X2.2
N$10
  Bottom 0.254: IC1.15 39.01,25.6 41.05,25.6 45.31,21.34 51.82,21.34 57.3,26.82 66.24,26.82 70.31,22.76 R6.1
N$11
  Top 0.254: R6.2 70.31,15.24 70.31,10.77 68.68,9.14 X2.1
N$12
  Top 0.254: IC1.5 46.53,33.33 55.07,33.33 57.3,31.09 70.71,31.09 72.54,32.92 R4.1
N$13
  Top 0.254: R4.2 72.54,24.99 72.54,10.36 68.28,6.1 67.46,6.1 X2.6
N$14
  Bottom 0.254: IC1.6 46.53,35.76 62.18,35.76 65.02,32.92 R9.1
N$15
  Top 0.254: IC1.7 46.53,38.41 52.43,38.41 57.91,32.92 R10.1
N$16
  Bottom 0.254: R9.2 65.02,9.96 64.62,9.55 64.62,6.3 X2.7
N$17
  Bottom 0.254: R10.2 57.91,13.41 61.77,9.55 61.77,6.3 X2.8
N$18
  Top 0.254: R12.1 4.67,54.46 4.67,61.16 TX2.A
N$19
  Top 0.254: R11.1 TX1.A
N$20
  Top 0.254: R15.1 89,15.24 91.44,17.68 C3.1 91.44,17.48 95.1,13.82 | 95.1,13.82 92.05,10.77 X3.1 | 95.1,13.82 R16.2
N$21
  Top 0.254: R13.1 30.07,53.65 30.07,61.16 RX1.A
N$22
  Top 0.254: R14.1 12.8,54.46 12.8,61.16 RX2.A
N$23
  Top 0.254: T1.2 123.75,26.21 123.75,26.82 125.37,28.45 125.37,31.7 R17.1
N$24
  Top 0.254: T2.2 151.38,25.2 151.38,29.67 152.81,31.09 R18.1
N$25
  Top 0.254: T3.2 114.4,27.64 114.4,31.7 R19.1
N$26
  Top 0.254: T4.2 141.63,26.62 141.63,31.09 R20.1
N$27
  Bottom 0.254: 103.43,36.17 100.58,36.17 D2.A | 103.43,36.17 104.85,36.17 106.68,38 106.68,42.88 109.93,46.13 K2.8 | 103.43,36.17 97.33,42.27 96.93,42.27 T6.1
N$28
  Top 0.254: K3.8 147.93,46.13 144.68,42.88 144.68,38.81 142.04,36.17 138.79,36.17 D3.A 138.38,36.37 138.38,38.61 134.93,42.06 T7.1
N$29
  Top 0.254: K2.5 110.13,38.61 111.76,40.23 111.76,45.92 103.23,54.46 88.39,54.46 85.75,57.1 84.94,57.1 S3.1
N$30
  Bottom 0.254: R24.A 70.51,62.99 73.15,60.35 84.12,60.35 84.73,59.74 S3.2
N$31
  Top 0.254: R22.1 91.85,37.59 94.69,40.44 94.69,41.05 T6.2
N$32
  Top 0.254: K1.8 74.78,46.13 71.53,42.88 71.53,38.81 68.89,36.17 65.63,36.17 D1.A 65.23,36.37 65.23,38.61 61.77,42.06 T5.1
N$33
  Top 0.254: T5.2 59.74,41.05 56.49,44.3 56.49,45.72 R21.1
N$34
  Top 0.254: R23.1 129.64,37.39 133.1,40.84 T7.2
N$35  (via drill 0.61)
  Top 0.254: v26.62,30.48 20.52,24.38 14.83,24.38 U1.23 | v33.12,39.42 v35.56,41.86
  Bottom 0.254: v26.62,30.48 26.62,32.92 v33.12,39.42 | v35.56,41.86 37.19,43.48 37.39,43.48 50.19,56.29 56.9,56.29 R26.1
N$36  (via drill 0.61)
  Top 0.254: v27.84,30.48 21.13,23.77 14.83,23.77 U1.22 | v32.11,37.19 32.11,50.19 38,56.08 R27.1
  Bottom 0.254: v27.84,30.48 27.84,32.92 v32.11,37.19
N$37
  Top 0.254: 65.63,57.91 71.73,64.01 R25.2 | 65.63,57.91 R24.S 64.62,57.91 | R24.E 61.98,61.57 65.63,57.91
N$38
  Top 0.254: R26.2 56.9,63.6 50.6,63.6 RX.K
N$39
  Top 0.254: R27.2 38,63.6 43.28,63.6 TX.K
N$40
  Bottom 0.254: K1.6 74.98,41.25 77.22,43.48 95.5,43.48 96.11,44.09 104.44,44.09 104.85,43.69 K2.2
N$42
  Top 0.254: U2.20 15.44,41.25 15.44,44.5 17.68,46.74 C13.1
N$43
  Top 0.254: U1.17 14.83,20.32 20.32,20.32 C8.1
PHONES_LEFT  (via drill 0.61)
  Top 0.254: v128.02,54.66 134.11,60.76 145.9,60.76 X4.5
  Bottom 0.254: 71.73,54.66 71.73,56.29 R25.1 | 71.73,54.66 71.73,43.08 69.9,41.25 K1.3 | 71.73,54.66 v128.02,54.66
PHONES_LEFT_R1
  Bottom 0.254: K1.2 69.7,43.69 68.07,42.06 68.07,38.81 69.29,37.59 73.56,37.59 86.56,24.59 92.46,24.59 102.62,14.43 106.27,14.43 109.73,10.97 113.59,10.97 RIG1.2
PHONES_LEFT_R2  (via drill 0.61)
  Top 0.254: v123.95,28.25 123.55,28.25 114.81,36.98 106.68,36.98 105.05,38.61 K2.4
  Bottom 0.254: K1.4 73.36,38.61 74.37,39.62 91.03,39.62 94.28,42.88 95.71,42.88 96.32,43.48 100.18,43.48 105.05,38.61 K2.4 | v123.95,28.25 125.17,27.03 125.17,25.81 140.21,10.77 144.88,10.77 RIG2.2
PHONES_RIGHT
  Top 0.254: 108.31,41.25 109.93,41.25 K2.6 | 108.31,41.25 105.05,41.25 K2.3 | 108.31,41.25 108.31,38.81 109.53,37.59 127,37.59 140.61,51.21 150.37,51.21 155.65,56.49 X4.2
PHONES_RIGHT_R1  (via drill 0.61)
  Top 0.254: v89.2,30.07 75.59,43.69 K1.7
  Bottom 0.254: v89.2,30.07 91.64,30.07 106.48,15.24 106.48,15.04 108.51,13.01 110.34,13.01 RIG1.3
PHONES_RIGHT_R2
  Top 0.254: K1.5 74.98,38.61 85.34,28.25 85.34,14.63 86.56,13.41 87.58,13.41 90.02,10.97 90.02,9.96 95.3,4.67 131.67,4.67 139.6,12.6 141.63,12.6 RIG2.3
PTT-R1
  Top 0.254: 121.72,24.79 127.41,24.79 C6.1 | 121.72,24.79 121.56,24.79 121.56,21.74 RIG1.4 | 121.72,24.79 T1.1
PTT-R2
  Top 0.254: RIG2.4 149.35,17.07 | 149.35,17.07 T2.1 | 149.35,17.07 156.06,23.77 C7.1
RESET  (via drill 0.61)
  Top 0.254: v15.44,36.37 10.77,36.37 U2.29 | v40.64,48.97 45.31,48.97 ICSP.5
  Bottom 0.254: v15.44,36.37 16.46,36.37 | 16.46,36.37 18.9,36.37 39.22,16.05 R28.1 | v40.64,48.97 34.54,42.88 19.3,42.88 16.46,40.03 16.46,36.37
RX
  Top 0.254: U1.1 7.52,27.64 5.49,27.64 R30.1
TX
  Top 0.254: U1.5 2.44,24.99 R29.1
USBDM  (via drill 0.61)
  Top 0.254: v17.27,19.36 15.65,19.71 14.83,19.71 U1.16
  Bottom 0.254: v17.27,19.36 16.26,17.27 8.74,9.75 X6.D-
USBDP  (via drill 0.61)
  Top 0.254: v13.87,17.32 14.63,19.1 U1.15
  Bottom 0.254: v13.87,17.32 6.91,10.36 6.91,9.55 8.74,7.72 X6.D+

### Text on the board
tPlace: OTRSP SO2Rduino V2 | NI2O 04/2011 | ENIcommunications Corp | http://www.enicomms.com